# Altium project Flight Controller.PrjPcb
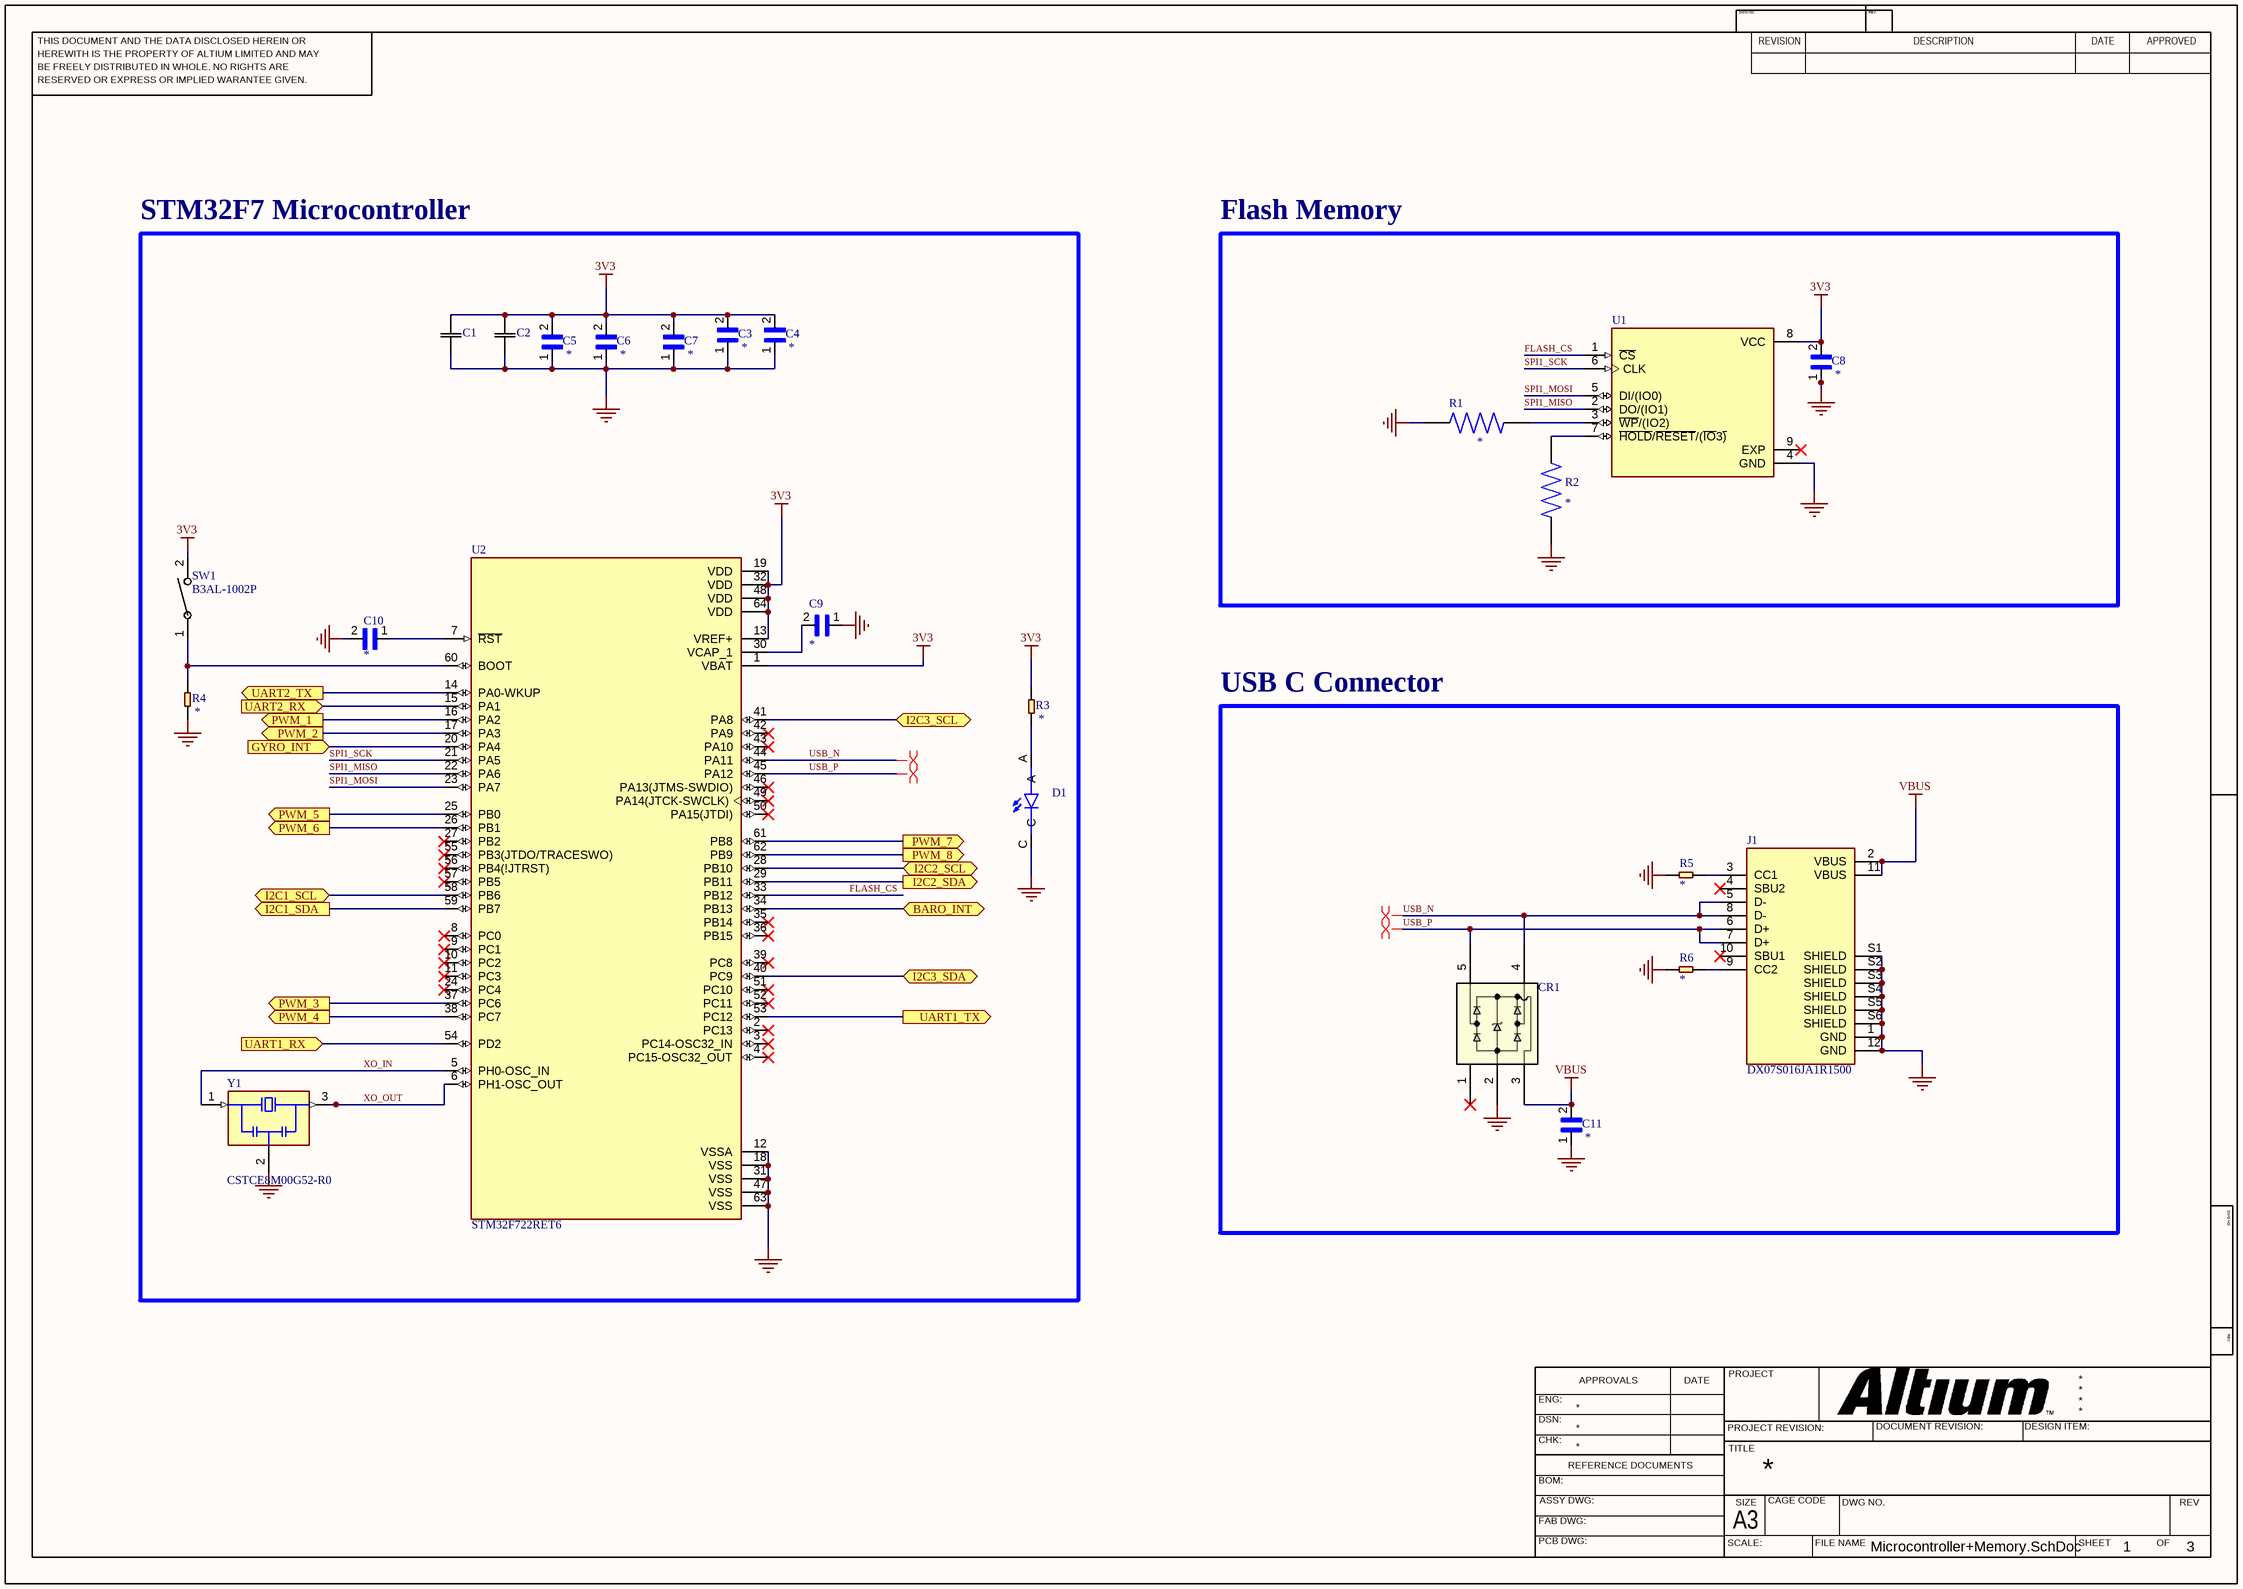
[diagram p0: Microcontroller+Memory.SchDoc]
3 sheets, 49 parts. Net scope: flat (ports and power ports of the same name join across sheets).
Board file: PCB1.PcbDoc
Sheets:
  Microcontroller+Memory.SchDoc
  Sensors.SchDoc
  Power Distribution.SchDoc

## Sheet Microcontroller+Memory.SchDoc
size 420 x 297 mm; SheetNumber: 1; SheetTotal: 3

### Parts
C1  CC0402MRX5R6BB106  [CAP_CC0402_YAG]  (value not drawn)
C2  CC0201MRX5R6BB105  [CAP_CC0201_YAG]  (value not drawn)
C3  GRM033R61A104KE15D  [CAPC0603X33N]  (value not drawn)
C4  GRM033R61A104KE15D  [CAPC0603X33N]  (value not drawn)
C5  GRM033R61A104KE15D  [CAPC0603X33N]  (value not drawn)
C6  GRM033R61A104KE15D  [CAPC0603X33N]  (value not drawn)
C7  GRM033R61A104KE15D  [CAPC0603X33N]  (value not drawn)
C8  GRM033R61A104KE15D  [CAPC0603X33N]  (value not drawn)
C9  CC0402MRX5R6BB475  [CAPC1005X55N]  (value not drawn)
C10  GRM033R61A104KE15D  [CAPC0603X33N]  (value not drawn)
C11  GRM033R61A104KE15D  [CAPC0603X33N]  (value not drawn)
CR1  SP3003-02XTG  [SOT553_LTF]  (value not drawn)
D1  LTST-C190KFKT  [LEDM1608X80]  (value not drawn)
J1  DX07S016JA1R1500  [JAE_DX07S016JA1R1500]
R1  ERA2AEB512X  [RES_ERA2AEB512X]  (value not drawn)
R2  ERA2AEB512X  [RES_ERA2AEB512X]  (value not drawn)
R3  SMD-RES-1K-5%-1/16W(0402)  [R0402]  (value not drawn)
R4  SMD-RES-1K-5%-1/16W(0402)  [R0402]  (value not drawn)
R5  SMD-RES-1K-5%-1/16W(0402)  [R0402]  (value not drawn)
R6  SMD-RES-1K-5%-1/16W(0402)  [R0402]  (value not drawn)
SW1  B3AL-1002P  [SW_3AL-1002P_OMR]
U1  W25Q256JVEIQ_TR  [SON127P600X800X80-9N]  (value not drawn)
U2  STM32F722RET6  [QFP50P1200X1200X160-64N]
Y1  CSTCE8M00G52-R0  [OSC_CSTCE8M00G52-R0]

### Blocks framed on the sheet
STM32F7 Microcontroller: C1-C7 C9 C10 D1 R3 R4 SW1 U2 Y1
Flash Memory: C8 R1 R2 U1
USB C Connector: C11 CR1 J1 R5 R6

### Ports
BARO_INT (bidir), GYRO_INT (in), I2C1_SCL (bidir), I2C1_SDA (out), I2C2_SCL (bidir), I2C2_SDA (out), I2C3_SCL (bidir), I2C3_SDA (bidir), PWM_1 (out), PWM_2 (out), PWM_3 (out), PWM_4 (out), PWM_5 (out), PWM_6 (out), PWM_7 (out), PWM_8 (out), UART1_RX (in), UART1_TX (out), UART2_RX (in), UART2_TX (out)

### Nets
3V3: C1.2 C2.2 C3.2 C4.2 C5.2 C6.2 C7.2 C8.2 R3.2 SW1.2 U1.8(VCC) U2.1(VBAT) U2.13(VREF+) U2.19(VDD) U2.32(VDD) U2.48(VDD) U2.64(VDD)
GND: C1.1 C2.1 C3.1 C4.1 C5.1 C6.1 C7.1 C8.1 C9.1 C10.2 C11.1 CR1.2 D1.C J1.1(GND) J1.12(GND) J1.S1(SHIELD) J1.S2(SHIELD) J1.S3(SHIELD) J1.S4(SHIELD) J1.S5(SHIELD) J1.S6(SHIELD) R1.1 R2.1 R4.1 R5.2 R6.2 U1.4(GND) U2.12(VSSA) U2.18(VSS) U2.31(VSS) U2.47(VSS) U2.63(VSS) Y1.2(GND)
VBUS: C11.2 CR1.3 J1.2(VBUS) J1.11(VBUS)
BARO_INT: U2.34(PB13) ; port BARO_INT
FLASH_CS: U1.1(~{CS}) U2.33(PB12)
GYRO_INT: U2.20(PA4) ; port GYRO_INT
I2C1_SCL: U2.58(PB6) ; port I2C1_SCL
I2C1_SDA: U2.59(PB7) ; port I2C1_SDA
I2C2_SCL: U2.28(PB10) ; port I2C2_SCL
I2C2_SDA: U2.29(PB11) ; port I2C2_SDA
I2C3_SCL: U2.41(PA8) ; port I2C3_SCL
I2C3_SDA: U2.40(PC9) ; port I2C3_SDA
PWM_1: U2.16(PA2) ; port PWM_1
PWM_2: U2.17(PA3) ; port PWM_2
PWM_3: U2.37(PC6) ; port PWM_3
PWM_4: U2.38(PC7) ; port PWM_4
PWM_5: U2.25(PB0) ; port PWM_5
PWM_6: U2.26(PB1) ; port PWM_6
PWM_7: U2.61(PB8) ; port PWM_7
PWM_8: U2.62(PB9) ; port PWM_8
SPI1_MISO: U1.2(DO/(IO1)) U2.22(PA6)
SPI1_MOSI: U1.5(DI/(IO0)) U2.23(PA7)
SPI1_SCK: U1.6(CLK) U2.21(PA5)
UART1_RX: U2.54(PD2) ; port UART1_RX
UART1_TX: U2.53(PC12) ; port UART1_TX
UART2_RX: U2.15(PA1) ; port UART2_RX
UART2_TX: U2.14(PA0-WKUP) ; port UART2_TX
USB_N: CR1.4 J1.5(D-) J1.8(D-) U2.44(PA11)
USB_P: CR1.5 J1.6(D+) J1.7(D+) U2.45(PA12)
XO_IN: U2.5(PH0-OSC_IN) Y1.1(IN)
XO_OUT: U2.6(PH1-OSC_OUT) Y1.3(OUT)
NetC9_2: C9.2 U2.30(VCAP_1)
NetC10_1: C10.1 U2.7(~{RST})
NetD1_A: D1.A R3.1
NetJ1_3: J1.3(CC1) R5.1
NetJ1_9: J1.9(CC2) R6.1
NetR1_2: R1.2 U1.3(~{WP}/(IO2))
NetR2_2: R2.2 U1.7(~{HOLD}/~{RESET}/(~{IO}3~{)})
NetR4_2: R4.2 SW1.1 U2.60(BOOT)

Not connected (* = marked no-connect by the designer): CR1 1*; J1 4(SBU2)* 10(SBU1)*; U1 9(EXP)*; U2 2(PC13)* 3(PC14-OSC32_IN)* 4(PC15-OSC32_OUT)* 8(PC0)* 9(PC1)* 10(PC2)* 11(PC3)* 24(PC4)* 27(PB2)* 35(PB14)* 36(PB15)* 39(PC8)* 42(PA9)* 43(PA10)* 46(PA13(JTMS-SWDIO))* 49(PA14(JTCK-SWCLK))* 50(PA15(JTDI))* 51(PC10)* 52(PC11)* 55(PB3(JTDO/TRACESWO))* 56(PB4(!JTRST))* 57(PB5)*

### Layout directives
differential pair: USB_N, USB_P

### Notes on the sheet
- THIS DOCUMENT AND THE DATA DISCLOSED HEREIN OR
- HEREWITH IS THE PROPERTY OF ALTIUM LIMITED AND MAY
- DWG NO:
- REVISION
- REV:
- DESCRIPTION
- DATE
- APPROVED
- BE FREELY DISTRIBUTED IN WHOLE. NO RIGHTS ARE
- RESERVED OR EXPRESS OR IMPLIED WARANTEE GIVEN.
- ENG:
- APPROVALS
- PROJECT
- DSN:
- CHK:
- REFERENCE DOCUMENTS
- PROJECT REVISION:
- TITLE
- DOCUMENT REVISION:
- DESIGN ITEM:
- BOM:
- FAB DWG:
- PCB DWG:
- ASSY DWG:
- SCALE:
- A3
- SIZE
- CAGE CODE
- FILE NAME
- DWG NO.
- SHEET
- OF
- REV

### Library data of the parts
C1 = CC0402MRX5R6BB106: No Description Available; Mfr_Name: Yageo
C2 = CC0201MRX5R6BB105: No Description Available; Mfr_Name: Yageo
C3-C8 C10 C11 = GRM033R61A104KE15D: SMD capacitor X5R(EIA) with capacitance 0.10uF Tol.10%. Rated voltage 10Vdc 85C; MF: Murata Electronics; Check_prices: https://www.snapeda.com/parts/GRM033R61A104KE15D/Murata%20Electronics%20North%20America/view-part/104758/?ref=eda; Value: *; Availability: Warning; Price: None; Package: 0603 Taiyo Yuden; MP: GRM033R61A104KE15D; Purchase-URL: https://pricing.snapeda.com/search/part/GRM033R61A104KE15D/?ref=eda; SnapEDA_Link: https://www.snapeda.com/parts/GRM033R61A104KE15D/Murata%20Electronics%20North%20America/view-part/104758/?ref=snap
C9 = CC0402MRX5R6BB475: 0402 4700000 pF 10 V Â±20 % Tol. X5R Surface Mount Multilayer Ceramic Capacitor; Package: None; Price: None; Value: *; MP: CC0402MRX5R6BB475; Availability: Unavailable
CR1 = SP3003-02XTG: No Description Available; Mfr_Name: Littelfuse Inc; RefDes: RefDes; Type: Type
D1 = LTST-C190KFKT: LED Uni-Color Orange 611nm 2-Pin Chip LED T/R; MF: Lite-On Electronics; Price: None; MP: LTST-C190KFKT; Purchase-URL: https://pricing.snapeda.com/search/part/LTST-C190KFKT/?ref=eda; Package: 0603 Lite-On; Check_prices: https://www.snapeda.com/parts/LTST-C190KFKT/Applied+Avionics/view-part/?ref=eda; SnapEDA_Link: https://www.snapeda.com/parts/LTST-C190KFKT/Applied+Avionics/view-part/?ref=snap; Value: *; Availability: In Stock
J1 = DX07S016JA1R1500: USB-C (USB TYPE-C) USB 2.0 Receptacle Connector 24 (16+8 Dummy) Position Surface Mount, Right Angle; Through Hole; Package: None; Value: *; Price: None; MP: DX07S016JA1R1500; Availability: Unavailable
R3-R6 = SMD-RES-1K-5%-1/16W(0402): 1 kOhms Â±5% 0.063W, 1/16W Chip Resistor 0402 (1005 Metric) Moisture Resistant Thick Film; MP: RC0402JR-071KL; MF: Yageo; Check_prices: https://www.snapeda.com/parts/RC0402JR-071KL/Yageo/view-part/?ref=eda; Value: *; Purchase-URL: https://pricing.snapeda.com/search/part/RC0402JR-071KL/?ref=eda; SnapEDA_Link: https://www.snapeda.com/parts/RC0402JR-071KL/Yageo/view-part/?ref=snap; Package: 0402 Yageo; Digi-Key_Part_Number: 311-1.0KJRTR-ND
SW1 = B3AL-1002P: No Description Available; Mfr_Name: Omron
U1 = W25Q256JVEIQ_TR: FLASH - NOR Memory IC 256Mb (32M x 8) SPI - Quad I/O 133 MHz 8-WSON (8x6); MP: W25Q256JVEIQ TR; MF: Winbond; Price: None; Purchase-URL: https://pricing.snapeda.com/search/part/W25Q256JVEIQ TR/?ref=eda; Package: WSON-8 Winbond; Check_prices: https://www.snapeda.com/parts/W25Q256JVEIQ%20TR/Winbond+Electronics/view-part/?ref=eda; Value: *; Availability: In Stock; SnapEDA_Link: https://www.snapeda.com/parts/W25Q256JVEIQ%20TR/Winbond+Electronics/view-part/?ref=snap
U2 = STM32F722RET6: ARMÂ® CortexÂ®-M7 STM32F7 Microcontroller IC 32-Bit 216MHz 512KB _512K x 8_ FLASH 64-LQFP _10x10_; MF: STMicroelectronics; SnapEDA_Link: https://www.snapeda.com/parts/STM32F722RET6/STMicroelectronics/view-part/696468/?ref=snap; Availability: Unavailable; Price: None; Package: LQFP-64 STMicroelectronics; MP: STM32F722RET6; Value: *
Y1 = CSTCE8M00G52-R0: 8MHz Ceramic Resonator Built in Capacitor 10pF Â±0.2% -20Â°C ~ 80Â°C Surface Mount; MF: Murata; Price: None; Check_prices: https://www.snapeda.com/parts/CSTCE8M00G52-R0/Murata%20Electronics%20North%20America/view-part/234504/?ref=eda; SnapEDA_Link: https://www.snapeda.com/parts/CSTCE8M00G52-R0/Murata%20Electronics%20North%20America/view-part/234504/?ref=snap; Package: Surface Mount Murata Electronics North America; Availability: Bad; MP: CSTCE8M00G52-R0; Value: *
R1 R2 = ERA2AEB512X: Availability: Unavailable; Package: None; Price: None; Value: *; MP: ERA2AEB512X

## Sheet Sensors.SchDoc
size B; SheetNumber: 2; SheetTotal: 3
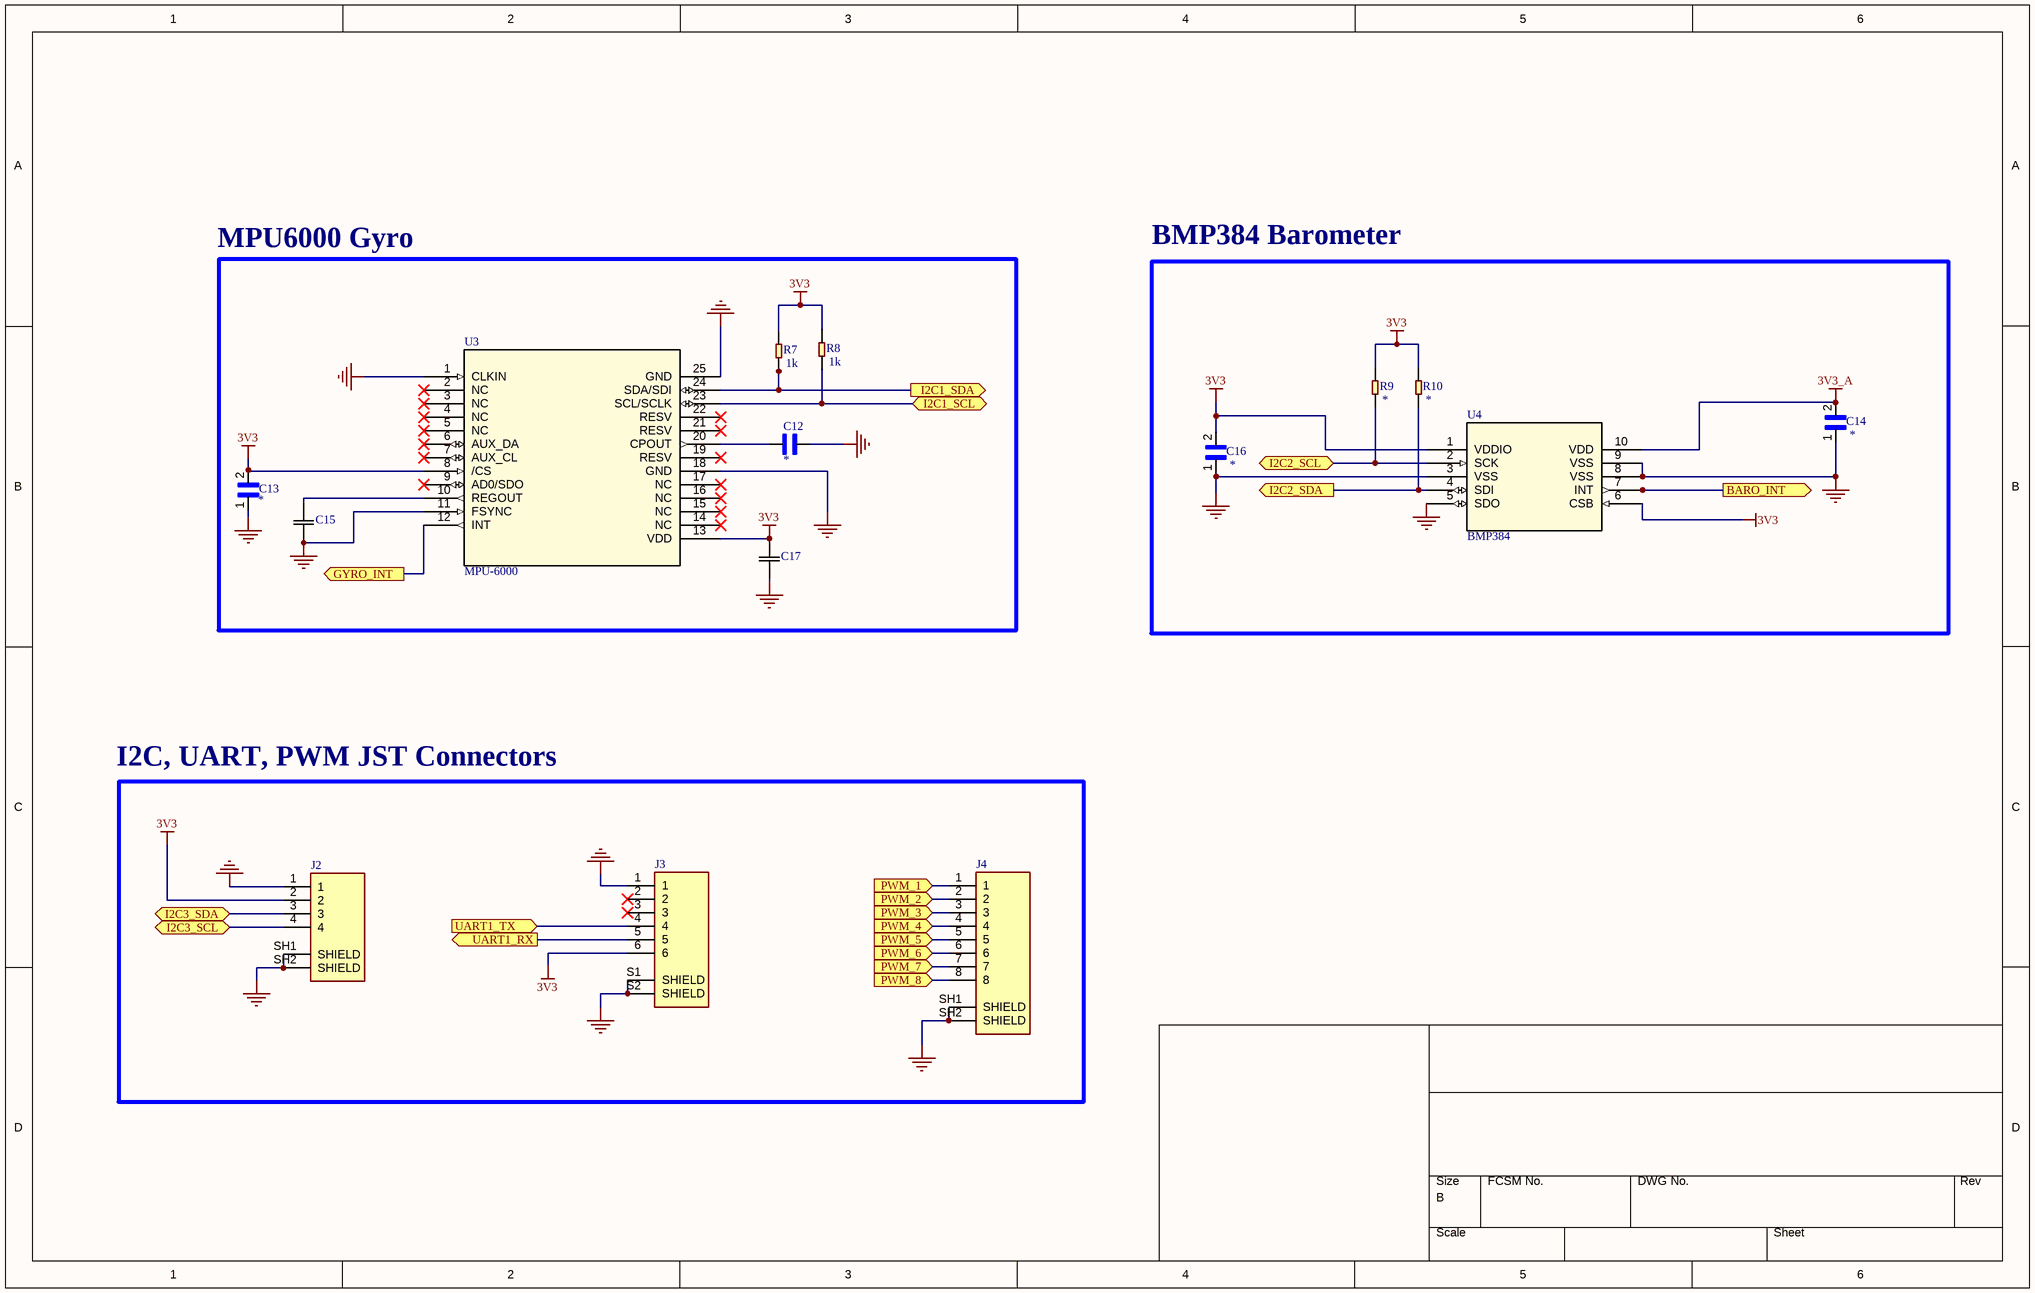
[diagram p1: Sensors.SchDoc]

### Parts
C12  GRM155R70J222KA01D  [CAPC1005X55N]  (value not drawn)
C13  GRM033R71A103KA01D  [CAPC0603X33N]  (value not drawn)
C14  GRM033R61A104KE15D  [CAPC0603X33N]  (value not drawn)
C15  CC0201MRX5R6BB105  [CAP_CC0201_YAG]  (value not drawn)
C16  GRM033R61A104KE15D  [CAPC0603X33N]  (value not drawn)
C17  CC0201MRX5R6BB105  [CAP_CC0201_YAG]  (value not drawn)
J2  SM04B-GHS-TB(LF)(SN)-  [JST_SM04B-GHS-TB(LF)(SN)-]  (value not drawn)
J3  SM06B-GHS-TB(LF)(SN)  [JST_SM06B-GHS-TB(LF)(SN)]  (value not drawn)
J4  SM08B-GHS-TB(LF)(SN)  [JST_SM08B-GHS-TB(LF)(SN)]  (value not drawn)
R7  value 1k  [R0402]  (hidden comment: SMD-RES-1K-5%-1/16W(0402))
R8  value 1k  [R0402]  (hidden comment: SMD-RES-1K-5%-1/16W(0402))
R9  SMD-RES-1K-5%-1/16W(0402)  [R0402]  (value not drawn)
R10  SMD-RES-1K-5%-1/16W(0402)  [R0402]  (value not drawn)
U3  MPU-6000  [QFN24_4X4X0P9_IVS]
U4  BMP384  [LGA10_2.0X2.0X0.95_BOS]

### Blocks framed on the sheet
MPU6000 Gyro: C12 C13 C15 C17 R7 R8 U3
BMP384 Barometer: C14 C16 R9 R10 U4
I2C, UART, PWM JST Connectors: J2-J4

### Ports
BARO_INT (out), GYRO_INT (out), I2C1_SCL (bidir), I2C1_SDA (out), I2C2_SCL (bidir), I2C2_SDA (out), I2C3_SCL (bidir), I2C3_SDA (bidir), PWM_1 (in), PWM_2 (in), PWM_3 (in), PWM_4 (in), PWM_5 (in), PWM_6 (in), PWM_7 (in), PWM_8 (in), UART1_RX (out), UART1_TX (in)

### Nets
3V3: C13.2 C16.2 C17.2 J2.2 J3.6 R7.2 R8.2 R9.2 R10.2 U3.8(/CS) U3.13(VDD) U4.1(VDDIO) U4.6(CSB)
3V3_A: C14.2 U4.10(VDD)
GND: C12.1 C13.1 C14.1 C15.1 C16.1 C17.1 J2.1 J2.SH1(SHIELD) J2.SH2(SHIELD) J3.1 J3.S1(SHIELD) J3.S2(SHIELD) J4.SH1(SHIELD) J4.SH2(SHIELD) U3.1(CLKIN) U3.11(FSYNC) U3.18(GND) U3.25(GND) U4.3(VSS) U4.5(SDO) U4.8(VSS) U4.9(VSS)
BARO_INT: U4.7(INT) ; port BARO_INT
GYRO_INT: U3.12(INT) ; port GYRO_INT
I2C1_SCL: R8.1 U3.23(SCL/SCLK) ; port I2C1_SCL
I2C1_SDA: R7.1 U3.24(SDA/SDI) ; port I2C1_SDA
I2C2_SCL: R9.1 U4.2(SCK) ; port I2C2_SCL
I2C2_SDA: R10.1 U4.4(SDI) ; port I2C2_SDA
I2C3_SCL: J2.4 ; port I2C3_SCL
I2C3_SDA: J2.3 ; port I2C3_SDA
PWM_1: J4.1 ; port PWM_1
PWM_2: J4.2 ; port PWM_2
PWM_3: J4.3 ; port PWM_3
PWM_4: J4.4 ; port PWM_4
PWM_5: J4.5 ; port PWM_5
PWM_6: J4.6 ; port PWM_6
PWM_7: J4.7 ; port PWM_7
PWM_8: J4.8 ; port PWM_8
UART1_RX: J3.5 ; port UART1_RX
UART1_TX: J3.4 ; port UART1_TX
NetC12_2: C12.2 U3.20(CPOUT)
NetC15_2: C15.2 U3.10(REGOUT)

Not connected (* = marked no-connect by the designer): J3 2* 3*; U3 2(NC)* 3(NC)* 4(NC)* 5(NC)* 6(AUX_DA)* 7(AUX_CL)* 9(AD0/SDO)* 14(NC)* 15(NC)* 16(NC)* 17(NC)* 19(RESV)* 21(RESV)* 22(RESV)*

### Notes on the sheet
- DWG. NO.
- REV.
- SHT.
- THIS DOCUMENT AND THE DATA DISCLOSED HEREIN OR HEREWITH IS THE PROPERTY OF ALTIUM LIMITED AND MAY BE FREELY DISTRIBUTED IN WHOLE. NO RIGHTS ARE RESERVED OR EXPRESS OR IMPLIED WARANTEE GIVEN.
- REVISION
- DESCRIPTION
- DATE
- APPROVED
- ENG:
- APPROVALS
- PROJECT
- DSN:
- CHK:
- REFERENCE DOCUMENTS
- PROJECT REVISION:
- TITLE
- DOCUMENT REVISION:
- DESIGN ITEM:
- BOM:
- FAB DWG:
- PCB DWG:
- ASSY DWG:
- SCALE:
- SIZE
- B
- CAGE CODE
- FILE NAME
- DWG NO.
- SHEET
- OF
- REV

### Library data of the parts
C12 = GRM155R70J222KA01D: Cap Ceramic 0.0022uF 6.3V X7R 10% SMD 0402 125Â°C Paper T/R; Package: None; Price: None; Value: *; MP: GRM155R70J222KA01D; Availability: Unavailable
C13 = GRM033R71A103KA01D: SMD Capacitor X7R(EIA) with Capacitance: 10000pF Tol. 10%. Rated Voltage: 10Vdc; MF: Murata; MP: GRM033R71A103KA01D; Availability: Unavailable; SnapEDA_Link: https://www.snapeda.com/parts/GRM033R71A103KA01D/Murata/view-part/4379446/?ref=snap; Value: *; Check_prices: https://www.snapeda.com/parts/GRM033R71A103KA01D/Murata/view-part/4379446/?ref=eda; Package: 0603 Taiyo Yuden; Price: None
C14 C16 = GRM033R61A104KE15D: as C3 on sheet Microcontroller+Memory; Check_prices: https://www.snapeda.com/parts/GRM033R61A104KE15D/Murata%20Electronics%20North%20America/view-part/104758/?ref=eda; Value: *; Availability: Warning; Price: None; Package: 0603 Taiyo Yuden; MP: GRM033R61A104KE15D; Purchase-URL: https://pricing.snapeda.com/search/part/GRM033R61A104KE15D/?ref=eda; SnapEDA_Link: https://www.snapeda.com/parts/GRM033R61A104KE15D/Murata%20Electronics%20North%20America/view-part/104758/?ref=snap
C15 C17 = CC0201MRX5R6BB105: as C2 on sheet Microcontroller+Memory
J2 = SM04B-GHS-TB(LF)(SN)-: Connector Header Surface Mount, Right Angle 4 position 0.049 _1.25mm_; MP: SM04B-GHS-TB_LF__SN_-; MF: JST Sales; Availability: Unavailable; Package: None; Value: *; Price: None; SnapEDA_Link: https://www.snapeda.com/parts/SM04B-GHS-TB%28LF%29%28SN%29-/JST%20Sales%20America%20Inc./view-part/2759740/?ref=snap
J3 = SM06B-GHS-TB(LF)(SN): ÐŸÐ¾Ð²ÐµÑ€Ñ…Ð½Ð¾ÑÑ‚Ð½Ñ‹Ð¹ Ð¼Ð¾Ð½Ñ‚Ð°Ð¶ Ñ€Ð°Ð·ÑŠÐµÐ¼Ð°, Ð¿Ñ€ÑÐ¼Ð¾Ð¹ ÑƒÐ³Ð¾Ð» 6, Ð¿Ð¾Ð»Ð¾Ð¶ÐµÐ½Ð¸Ðµ 0,049 _1,25 Ð¼Ð¼_; MP: SM06B-GHS-TB_LF__SN_; MF: JST Sales; Value: *; Package: None; Price: None; Availability: Unavailable; SnapEDA_Link: https://www.snapeda.com/parts/SM06B-GHS-TB%28LF%29%28SN%29/JST%20Sales%20America%20Inc./view-part/817690/?ref=snap
J4 = SM08B-GHS-TB(LF)(SN): Connector Header Surface Mount, Right Angle 8 position 0.049 _1.25mm_; MF: JST Sales; MP: SM08B-GHS-TB_LF__SN_; Value: *; Digi-Key_Part_Number: 455-1570-1-ND; Package: None; Digi-Key_Purchase_URL: https://www.digikey.com/product-detail/en/jst-sales-america-inc/SM08B-GHS-TB_LF__SN_/455-1570-1-ND/807838?utm_source=snapeda&utm_medium=aggregator&utm_campaign=symbol; SnapEDA_Link: https://www.snapeda.com/parts/SM08B-GHS-TB%28LF%29%28SN%29/JST%20Sales%20America%20Inc./view-part/1162121/?ref=snap
R7-R10 = SMD-RES-1K-5%-1/16W(0402): as R3 on sheet Microcontroller+Memory; Check_prices: https://www.snapeda.com/parts/RC0402JR-071KL/Yageo/view-part/?ref=eda; Purchase-URL: https://pricing.snapeda.com/search/part/RC0402JR-071KL/?ref=eda; SnapEDA_Link: https://www.snapeda.com/parts/RC0402JR-071KL/Yageo/view-part/?ref=snap; Package: 0402 Yageo; Digi-Key_Part_Number: 311-1.0KJRTR-ND
  R9 R10: Value: *
U3 = MPU-6000: No Description Available; Mfr_Name: InvenSense; RefDes: RefDes; Type: Type
U4 = BMP384: No Description Available; Mfr_Name: Bosch Sensortec; RefDes: RefDes; Type: Type

## Sheet Power Distribution.SchDoc
size A; SheetNumber: 3; SheetTotal: 3
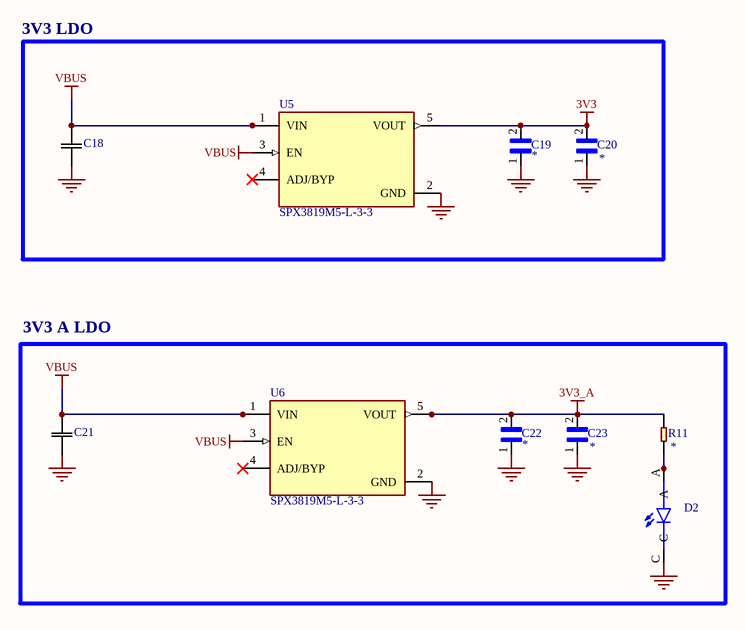
[diagram p2: Power Distribution.SchDoc]

### Parts
C18  CC0201MRX5R6BB105  [CAP_CC0201_YAG]  (value not drawn)
C19  GRM033R71A103KA01D  [CAPC0603X33N]  (value not drawn)
C20  GRM155C80J225KE95D  [CAPC1005X55N]  (value not drawn)
C21  CC0201MRX5R6BB105  [CAP_CC0201_YAG]  (value not drawn)
C22  GRM033R71A103KA01D  [CAPC0603X33N]  (value not drawn)
C23  GRM155C80J225KE95D  [CAPC1005X55N]  (value not drawn)
D2  LTST-C190KFKT  [LEDM1608X80]  (value not drawn)
R11  SMD-RES-1K-5%-1/16W(0402)  [R0402]  (value not drawn)
U5  SPX3819M5-L-3-3  [SOT95P280X145-5N]
U6  SPX3819M5-L-3-3  [SOT95P280X145-5N]

### Blocks framed on the sheet
3V3 LDO: C18-C20 U5
3V3 A LDO: C21-C23 D2 R11 U6

### Nets
3V3: C19.2 C20.2 U5.5(VOUT)
3V3_A: C22.2 C23.2 R11.2 U6.5(VOUT)
GND: C18.1 C19.1 C20.1 C21.1 C22.1 C23.1 D2.C U5.2(GND) U6.2(GND)
VBUS: C18.2 C21.2 U5.1(VIN) U5.3(EN) U6.1(VIN) U6.3(EN)
NetD2_A: D2.A R11.1

Not connected (* = marked no-connect by the designer): U5 4(ADJ/BYP)*; U6 4(ADJ/BYP)*

### Library data of the parts
C18 C21 = CC0201MRX5R6BB105: as C2 on sheet Microcontroller+Memory
C19 C22 = GRM033R71A103KA01D: as C13 on sheet Sensors; MP: GRM033R71A103KA01D; Availability: Unavailable; SnapEDA_Link: https://www.snapeda.com/parts/GRM033R71A103KA01D/Murata/view-part/4379446/?ref=snap; Value: *; Check_prices: https://www.snapeda.com/parts/GRM033R71A103KA01D/Murata/view-part/4379446/?ref=eda; Package: 0603 Taiyo Yuden; Price: None
C20 C23 = GRM155C80J225KE95D: 2.2ÂµF Â±10% 6.3V Ceramic Capacitor X6S 0402 (1005 Metric); MF: Murata; Digi-Key_Part_Number: 490-10012-1-ND; Check_prices: https://www.snapeda.com/parts/GRM155C80J225KE95D/Murata%20Electronics%20North%20America/view-part/1764715/?ref=eda; MP: GRM155C80J225KE95D; Value: *; SnapEDA_Link: https://www.snapeda.com/parts/GRM155C80J225KE95D/Murata%20Electronics%20North%20America/view-part/1764715/?ref=snap; Package: 1005 Taiyo Yuden; Purchase-URL: https://pricing.snapeda.com/search/part/GRM155C80J225KE95D/?ref=eda
D2 = LTST-C190KFKT: as D1 on sheet Microcontroller+Memory; Price: None; MP: LTST-C190KFKT; Purchase-URL: https://pricing.snapeda.com/search/part/LTST-C190KFKT/?ref=eda; Package: 0603 Lite-On; Check_prices: https://www.snapeda.com/parts/LTST-C190KFKT/Applied+Avionics/view-part/?ref=eda; SnapEDA_Link: https://www.snapeda.com/parts/LTST-C190KFKT/Applied+Avionics/view-part/?ref=snap; Value: *; Availability: In Stock
R11 = SMD-RES-1K-5%-1/16W(0402): as R3 on sheet Microcontroller+Memory; Check_prices: https://www.snapeda.com/parts/RC0402JR-071KL/Yageo/view-part/?ref=eda; Value: *; Purchase-URL: https://pricing.snapeda.com/search/part/RC0402JR-071KL/?ref=eda; SnapEDA_Link: https://www.snapeda.com/parts/RC0402JR-071KL/Yageo/view-part/?ref=snap; Package: 0402 Yageo; Digi-Key_Part_Number: 311-1.0KJRTR-ND
U5 U6 = SPX3819M5-L-3-3: Linear Voltage Regulator IC Positive Fixed 1 Output 500mA SOT-23-5; MF: MaxLinear, Inc.; MP: SPX3819M5-L-3-3/TR; SnapEDA_Link: https://www.snapeda.com/parts/SPX3819M5-L-3-3/TR/MaxLinear%252C+Inc./view-part/?ref=snap; Package: SOT-23-5 Exar; Value: *; Check_prices: https://www.snapeda.com/parts/SPX3819M5-L-3-3/TR/MaxLinear%252C+Inc./view-part/?ref=eda

## Nets that join several sheets
3V3: Microcontroller+Memory (17 pins), Sensors (13 pins), Power Distribution (C19.2 C20.2 U5.5)
3V3_A: Sensors (C14.2 U4.10), Power Distribution (C22.2 C23.2 R11.2 U6.5)
GND: Microcontroller+Memory (33 pins), Sensors (22 pins), Power Distribution (9 pins)
VBUS: Microcontroller+Memory (C11.2 CR1.3 J1.2 J1.11), Power Distribution (6 pins)
BARO_INT: Microcontroller+Memory (U2.34), Sensors (U4.7)
GYRO_INT: Microcontroller+Memory (U2.20), Sensors (U3.12)
I2C1_SCL: Microcontroller+Memory (U2.58), Sensors (R8.1 U3.23)
I2C1_SDA: Microcontroller+Memory (U2.59), Sensors (R7.1 U3.24)
I2C2_SCL: Microcontroller+Memory (U2.28), Sensors (R9.1 U4.2)
I2C2_SDA: Microcontroller+Memory (U2.29), Sensors (R10.1 U4.4)
I2C3_SCL: Microcontroller+Memory (U2.41), Sensors (J2.4)
I2C3_SDA: Microcontroller+Memory (U2.40), Sensors (J2.3)
PWM_1: Microcontroller+Memory (U2.16), Sensors (J4.1)
PWM_2: Microcontroller+Memory (U2.17), Sensors (J4.2)
PWM_3: Microcontroller+Memory (U2.37), Sensors (J4.3)
PWM_4: Microcontroller+Memory (U2.38), Sensors (J4.4)
PWM_5: Microcontroller+Memory (U2.25), Sensors (J4.5)
PWM_6: Microcontroller+Memory (U2.26), Sensors (J4.6)
PWM_7: Microcontroller+Memory (U2.61), Sensors (J4.7)
PWM_8: Microcontroller+Memory (U2.62), Sensors (J4.8)
UART1_RX: Microcontroller+Memory (U2.54), Sensors (J3.5)
UART1_TX: Microcontroller+Memory (U2.53), Sensors (J3.4)